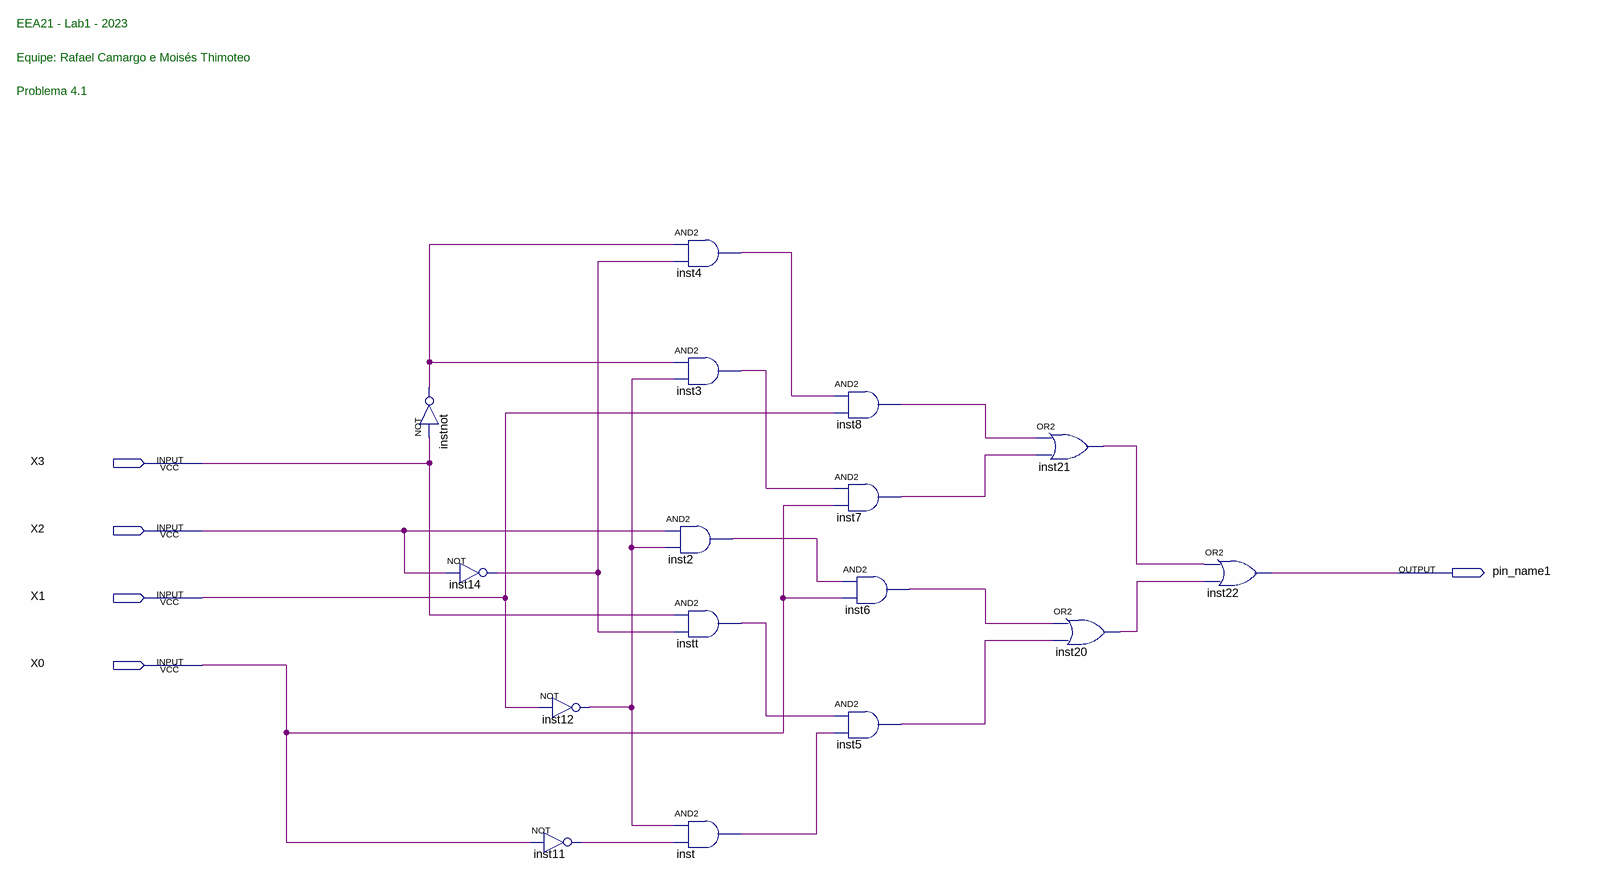
[diagram p0: schematic sheet]
// Quartus schematic Problema41.bdf as structural Verilog: 16 symbols, 5 pins
module Problema41 (
  input  X3,
  input  X2,
  input  X1,
  input  X0,
  output pin_name1
);

  wire inst2_out, inst3_out, inst4_out, inst5_out, inst6_out, inst7_out, inst8_out, inst11_out, inst12_out,
       inst14_out, inst20_out, inst21_out, inst_out, instnot_out, instt_out;

  not instnot (instnot_out, X3);
  not inst14 (inst14_out, X2);
  not inst12 (inst12_out, X1);
  not inst11 (inst11_out, X0);
  and inst4 (inst4_out, instnot_out, inst14_out);
  and inst3 (inst3_out, instnot_out, inst12_out);
  and inst2 (inst2_out, X2, inst12_out);
  and instt (instt_out, X3, inst14_out);
  and inst (inst_out, inst12_out, inst11_out);
  and inst8 (inst8_out, inst4_out, X1);
  and inst7 (inst7_out, inst3_out, X0);
  and inst6 (inst6_out, inst2_out, X0);
  and inst5 (inst5_out, instt_out, inst_out);
  or inst21 (inst21_out, inst8_out, inst7_out);
  or inst20 (inst20_out, inst6_out, inst5_out);
  or inst22 (pin_name1, inst21_out, inst20_out);

  // Notes on the sheet:
  //   EEA21 - Lab1 - 2023                                
  //   Equipe: Rafael Camargo e Moisés Thimoteo                               
  //   Problema 4.1          
endmodule
